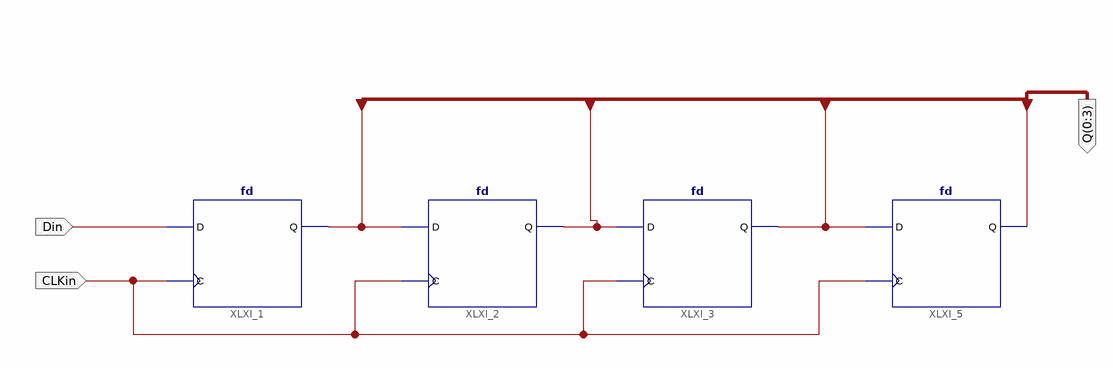
[diagram p0: schematic sheet 1]
// Xilinx ISE schematic shift_reg.sch (spartan3e) as structural Verilog: 4 symbols, 3 ports
module shift_reg (
  input  Din,
  input  CLKin,
  output [0:3] Q
);

  fd XLXI_1 (.C(CLKin), .D(Din), .Q(Q[0]));
  fd XLXI_2 (.C(CLKin), .D(Q[0]), .Q(Q[1]));
  fd XLXI_3 (.C(CLKin), .D(Q[1]), .Q(Q[2]));
  fd XLXI_5 (.C(CLKin), .D(Q[2]), .Q(Q[3]));
endmodule
